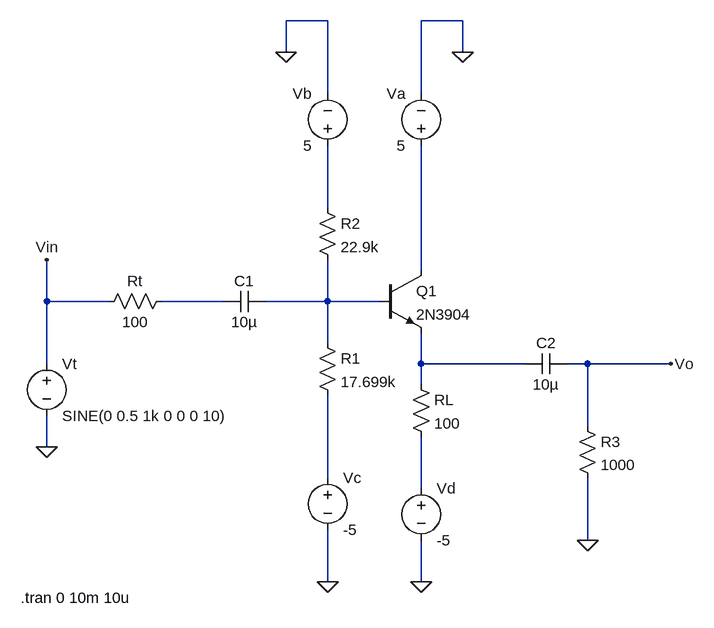
[diagram p0: schematic Amplifier Simulation.asc]
Amplifier Simulation.asc, the LTspice schematic file:
Version 4.1
SHEET 1 1464 680
WIRE 544 -752 480 -752
WIRE 752 -752 688 -752
WIRE 480 -704 480 -752
WIRE 752 -704 752 -752
WIRE 544 -640 544 -752
WIRE 688 -640 688 -752
WIRE 544 -464 544 -560
WIRE 688 -368 688 -560
WIRE 112 -320 112 -384
WIRE 208 -320 112 -320
WIRE 384 -320 288 -320
WIRE 544 -320 544 -384
WIRE 544 -320 448 -320
WIRE 624 -320 544 -320
WIRE 544 -256 544 -320
WIRE 112 -224 112 -320
WIRE 688 -224 688 -272
WIRE 848 -224 688 -224
WIRE 944 -224 912 -224
WIRE 1072 -224 944 -224
WIRE 688 -192 688 -224
WIRE 944 -128 944 -224
WIRE 112 -96 112 -144
WIRE 544 -48 544 -176
WIRE 688 -32 688 -112
WIRE 944 48 944 -48
WIRE 544 112 544 32
WIRE 688 112 688 48
FLAG 112 -96 0
FLAG 688 112 0
FLAG 544 112 0
FLAG 1072 -224 Vo
FLAG 480 -704 0
FLAG 752 -704 0
FLAG 112 -384 Vin
FLAG 944 48 0
SYMBOL voltage 112 -240 R0
WINDOW 123 0 0 Left 0
WINDOW 39 0 0 Left 0
SYMATTR InstName Vt
SYMATTR Value SINE(0 0.5 1k 0 0 0 10)
SYMBOL res 304 -336 R90
WINDOW 0 0 56 VBottom 2
WINDOW 3 32 56 VTop 2
SYMATTR InstName Rt
SYMATTR Value 100
SYMBOL cap 448 -336 R90
WINDOW 0 0 32 VBottom 2
WINDOW 3 32 32 VTop 2
SYMATTR InstName C1
SYMATTR Value 10µ
SYMBOL res 528 -480 R0
SYMATTR InstName R2
SYMATTR Value 22.9k
SYMBOL res 528 -272 R0
SYMATTR InstName R1
SYMATTR Value 17.699k
SYMBOL voltage 544 -544 R180
WINDOW 0 24 96 Left 2
WINDOW 3 24 16 Left 2
SYMATTR InstName Vb
SYMATTR Value 5
SYMBOL voltage 688 -544 R180
WINDOW 0 24 96 Left 2
WINDOW 3 24 16 Left 2
SYMATTR InstName Va
SYMATTR Value 5
SYMBOL res 672 -208 R0
SYMATTR InstName RL
SYMATTR Value 100
SYMBOL voltage 544 -64 R0
SYMATTR InstName Vc
SYMATTR Value -5
SYMBOL voltage 688 -48 R0
SYMATTR InstName Vd
SYMATTR Value -5
SYMBOL cap 912 -240 R90
WINDOW 0 0 32 VBottom 2
WINDOW 3 32 32 VTop 2
SYMATTR InstName C2
SYMATTR Value 10µ
SYMBOL npn 624 -368 R0
SYMATTR InstName Q1
SYMATTR Value 2N3904
SYMBOL res 928 -144 R0
SYMATTR InstName R3
SYMATTR Value 1000
TEXT 72 136 Left 2 !.tran 0 10m 10u

The netlist it stands for:
* Amplifier Simulation.asc
Vt Vin 0 SINE(0 0.5 1k 0 0 0 10)
Rt N003 Vin 100
C1 N004 N003 10µ
R2 N001 N004 22.9k
R1 N004 N006 17.699k
Vb N001 0 5
Va N002 0 5
RL N005 N007 100
Vc N006 0 -5
Vd N007 0 -5
C2 Vo N005 10µ
Q1 N002 N004 N005 0 2N3904
R3 Vo 0 1000
.model NPN NPN
.model PNP PNP
.lib standard.bjt
.tran 0 10m 10u
.backanno
.end